# Altium schematic sheet Sheet2.SchDoc
size A; SheetNumber: 1; SheetTotal: 1
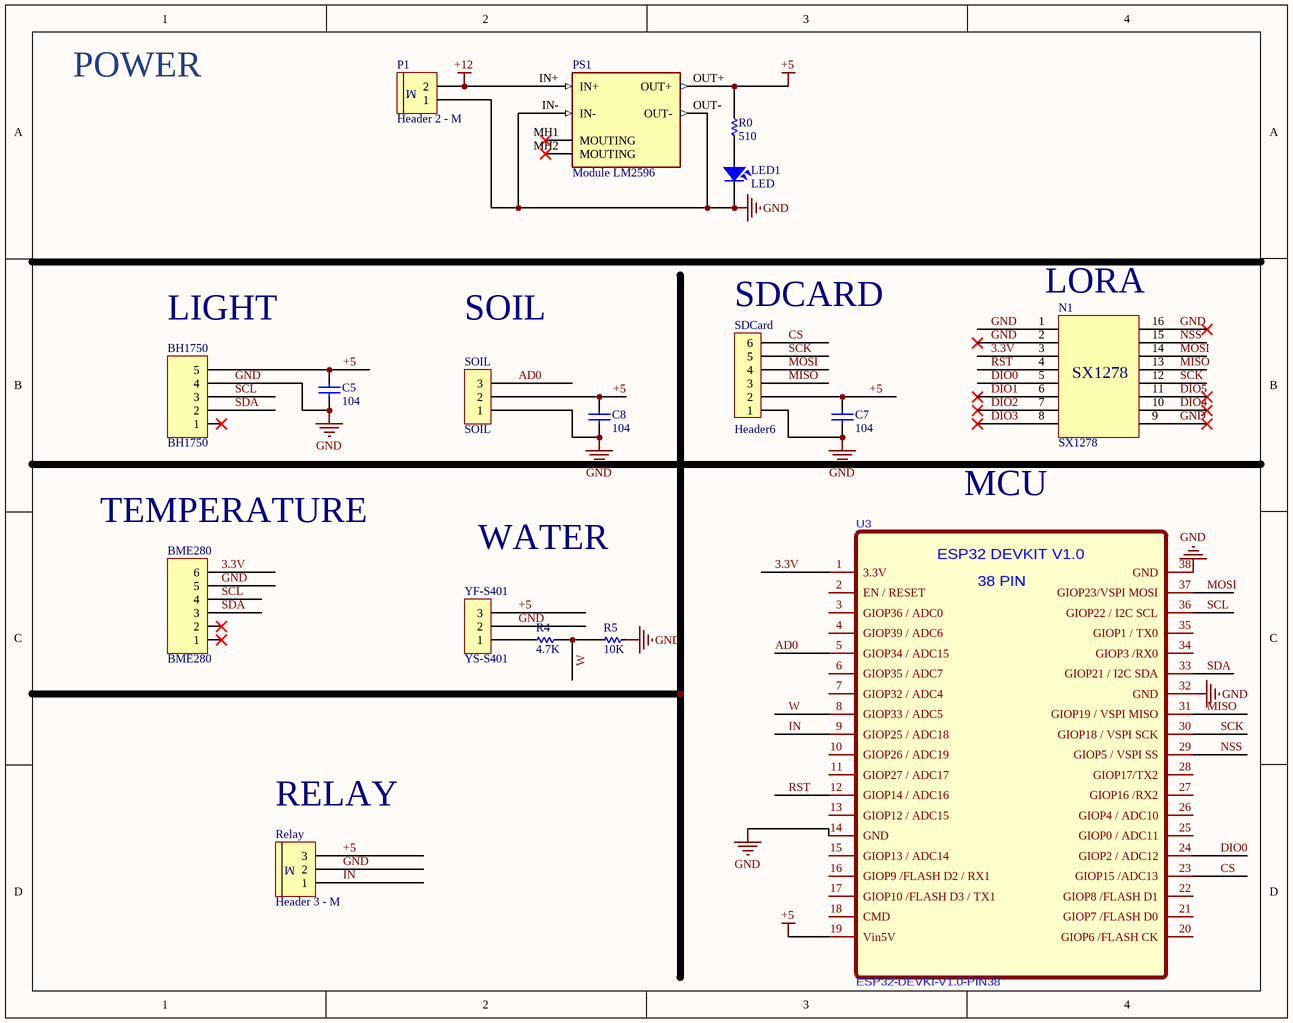
[diagram p0: Sheet2.SchDoc]

## Parts
BH1750  BH1750  [JP5-C1T]
BME280  BME280  [JP6-C1T]
C5  value 104  [Tu-pico]  (hidden comment: Capacitor Ceramic)
C7  value 104  [Tu-pico]  (hidden comment: Capacitor Ceramic)
C8  value 104  [Tu-pico]  (hidden comment: Capacitor Ceramic)
LED1  LED  [LED-3]
N1  SX1278  [DIP16]
P1  Header 2 - M  [Medium - Header 2]
PS1  Module LM2596  [CONV_MC00100]
R0  510  [RES-1/2W]
R4  4.7K  [RES-1/2W]
R5  10K  [RES-1/2W]
Relay  Header 3 - M  [Medium - Header 3]
SDCard  Header6  [HDR6]
SOIL  SOIL  [JP3-D1T]
U3  ESP32-DEVKI-V1.0-PIN38  [ESP32-DEVKIT-V1.0-38PIN]
YF-S401  YS-S401  [JP3-D1T]

## Nets
+5: BH1750.5 C5.2 C7.2 C8.2 PS1.OUT+ R0.1 Relay.3 SDCard.2 SOIL.2 U3.19(Vin5V) YF-S401.3
+12: P1.2 PS1.IN+
GND: BH1750.4 BME280.5 C5.1 C7.1 C8.1 LED1.2 N1.1 N1.2 N1.9 N1.16 P1.1 PS1.IN- PS1.OUT- R5.2 Relay.2 SDCard.1 SOIL.1 U3.14(GND) U3.32(GND) U3.38(GND) YF-S401.2
3.3V: BME280.6 N1.3 U3.1(3.3V)
AD0: SOIL.3 U3.5(GIOP34_/_ADC15)
CS: SDCard.6 U3.23(GIOP15_/ADC13)
DIO0: N1.5 U3.24(GIOP2_/_ADC12)
DIO1: N1.6
DIO2: N1.7
DIO3: N1.8
DIO4: N1.10
DIO5: N1.11
IN: Relay.1 U3.9(GIOP25_/_ADC18)
MISO: N1.13 SDCard.3 U3.31(GIOP19_/_VSPI_MISO)
MOSI: N1.14 SDCard.4 U3.37(GIOP23/VSPI_MOSI)
NSS: N1.15 U3.29(GIOP5_/_VSPI_SS)
RST: N1.4 U3.12(GIOP14_/_ADC16)
SCK: N1.12 SDCard.5 U3.30(GIOP18_/_VSPI_SCK)
SCL: BH1750.3 BME280.4 U3.36(GIOP22_/_I2C_SCL)
SDA: BH1750.2 BME280.3 U3.33(GIOP21_/_I2C_SDA)
W: R4.1 R5.1 U3.8(GIOP33_/_ADC5)
NetLED1_1: LED1.1 R0.2
NetR4_2: R4.2 YF-S401.1

Not connected (* = marked no-connect by the designer): BH1750 1*; BME280 1* 2*; PS1 MH1(MOUTING)* MH2(MOUTING)*; U3 2(EN_/_RESET) 3(GIOP36_/_ADC0) 4(GIOP39_/_ADC6) 6(GIOP35_/_ADC7) 7(GIOP32_/_ADC4) 10(GIOP26_/_ADC19) 11(GIOP27_/_ADC17) 13(GIOP12_/_ADC15) 15(GIOP13_/_ADC14) 16(GIOP9_/FLASH_D2_/_RX1) 17(GIOP10_/FLASH_D3_/_TX1) 18(CMD) 20(GIOP6_/FLASH_CK) 21(GIOP7_/FLASH_D0) 22(GIOP8_/FLASH_D1) 25(GIOP0_/_ADC11) 26(GIOP4_/_ADC10) 27(GIOP16_/RX2) 28(GIOP17/TX2) 34(GIOP3_/RX0) 35(GIOP1_/_TX0)

## Notes on the sheet
- POWER
- (near N1) LORA
- (near BH1750) LIGHT
- SOIL
- (near SDCard) SDCARD
- MCU
- (near BME280) TEMPERATURE
- WATER
- (near Relay) RELAY
- (in symbol ESP32-DEVKI-V1.0-PIN38) ESP32 DEVKIT V1.0; 38 PIN
- (in symbol Header 2 - M) M
- (in symbol Header 3 - M) M

## Library data of the parts
BH1750 = JP5: WR-PHD 2.54 mm Angled Socket Header; Manufacturer: W¨¹rth Elektronik eiSos GmbH; partNo: 613005143121; ComponentLink1 Description: Manufacturer; ComponentLink2 Description: Datasheet; NoPins: 05; Created Date: 29 March 2013; ComponentLink1URL: http://www.we-online.com; ComponentLink2URL: http://katalog.we-online.de/em/datasheet/6130xx143121.pdf; Created by: Karrer Zheng
BME280 = JP6: WR-PHD 2.54 mm Angled Socket Header; Manufacturer: W¨¹rth Elektronik eiSos GmbH; partNo: 613006143121; ComponentLink1 Description: Manufacturer; ComponentLink2 Description: Datasheet; NoPins: 06; Created Date: 29 March 2013; ComponentLink1URL: http://www.we-online.com; ComponentLink2URL: http://katalog.we-online.de/em/datasheet/6130xx143121.pdf; Created by: Karrer Zheng
C5 C7 C8 = CapCeramic: Capacitor; Published: 8-Jun-2000; LatestRevisionDate: 17-Jul-2002; LatestRevisionNote: Re-released for DXP Platform.; PackageReference: RAD-0.3; Publisher: Altium Limited
LED1 = LED: LED Single colour Green and Red; Value: LED 3 ly Single Colour
P1 = Header 2 - M: Header, 2-Pin, Medium; LatestRevisionDate: 17-Jul-2002; LatestRevisionNote: Re-released for DXP Platform.; Publisher: Altium Limited
PS1 = MC00100: DC-DC LM2596 Step Down Adjustable Converter Power Supply Module 1.3V-35V; MF: YKS; SnapEDA_Link: https://www.snapeda.com/parts/MC00100/YKS/view-part/?ref=snap; Package: None; Value: *; MP: MC00100; Check_prices: https://www.snapeda.com/parts/MC00100/YKS/view-part/?ref=eda
R0 R4 R5 = Res: Manufacturer: Generic Components; Class: Passive; SubClass: R; Published: 08/06/2000; Publisher: Altium Hobart Technology Centre
Relay = Header 3 - M: Header, 3-Pin, Medium; LatestRevisionDate: 17-Jul-2002; LatestRevisionNote: Re-released for DXP Platform.; Publisher: Altium Limited
SDCard = Header6: Header IDC, 6 x 1 Pin Vertical 2.54mm Pitch (Non-Boxed, Male); Manufacturer: W¨¹rth Elektronik eiSos GmbH; partNo: 613002143121; ComponentLink1 Description: Manufacturer; ComponentLink2 Description: Datasheet; NoPins: 02; Created Date: 29 March 2013; ComponentLink1URL: http://www.we-online.com; ComponentLink2URL: http://katalog.we-online.de/em/datasheet/6130xx143121.pdf; Created by: Karrer Zheng
SOIL YF-S401 = JP3: WR-PHD 2.54 mm Angled Socket Header; Manufacturer: W¨¹rth Elektronik eiSos GmbH; partNo: 613003143121; ComponentLink1 Description: Manufacturer; ComponentLink2 Description: Datasheet; NoPins: 03; Created Date: 29 March 2013; ComponentLink1URL: http://www.we-online.com; ComponentLink2URL: http://katalog.we-online.de/em/datasheet/6130xx143121.pdf; Created by: Karrer Zheng